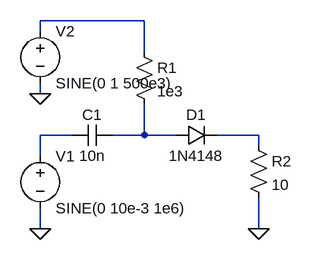
[diagram p0: schematic diode.asc]
diode.asc, the LTspice schematic file:
Version 4
SHEET 1 880 680
WIRE 96 16 -64 16
WIRE -64 32 -64 16
WIRE 96 64 96 16
WIRE -64 128 -64 112
WIRE -16 192 -64 192
WIRE 96 192 96 144
WIRE 96 192 48 192
WIRE 144 192 96 192
WIRE 272 192 208 192
WIRE 272 208 272 192
WIRE -64 224 -64 192
WIRE -64 336 -64 304
WIRE 272 336 272 288
FLAG -64 128 0
FLAG -64 336 0
FLAG 272 336 0
SYMBOL res 80 48 R0
SYMATTR InstName R1
SYMATTR Value 1e3
SYMBOL res 256 192 R0
SYMATTR InstName R2
SYMATTR Value 10
SYMBOL diode 144 208 R270
WINDOW 0 32 32 VTop 2
WINDOW 3 0 32 VBottom 2
SYMATTR InstName D1
SYMATTR Value 1N4148
SYMBOL cap 48 176 R90
WINDOW 0 0 32 VBottom 2
WINDOW 3 32 32 VTop 2
SYMATTR InstName C1
SYMATTR Value 10n
SYMBOL voltage -64 208 R0
WINDOW 123 0 0 Left 0
WINDOW 39 0 0 Left 0
SYMATTR InstName V1
SYMATTR Value SINE(0 10e-3 1e6)
SYMBOL voltage -64 16 R0
WINDOW 123 0 0 Left 0
WINDOW 39 0 0 Left 0
SYMATTR InstName V2
SYMATTR Value SINE(0 1 500e3)

The netlist it stands for:
* diode.asc
R1 N001 N003 1e3
R2 N004 0 10
D1 N003 N004 1N4148
C1 N003 N002 10n
V1 N002 0 SINE(0 10e-3 1e6)
V2 N001 0 SINE(0 1 500e3)
.model D D
.lib standard.dio
.backanno
.end